# Altium schematic sheet DEVICE2.SchDoc
size A4
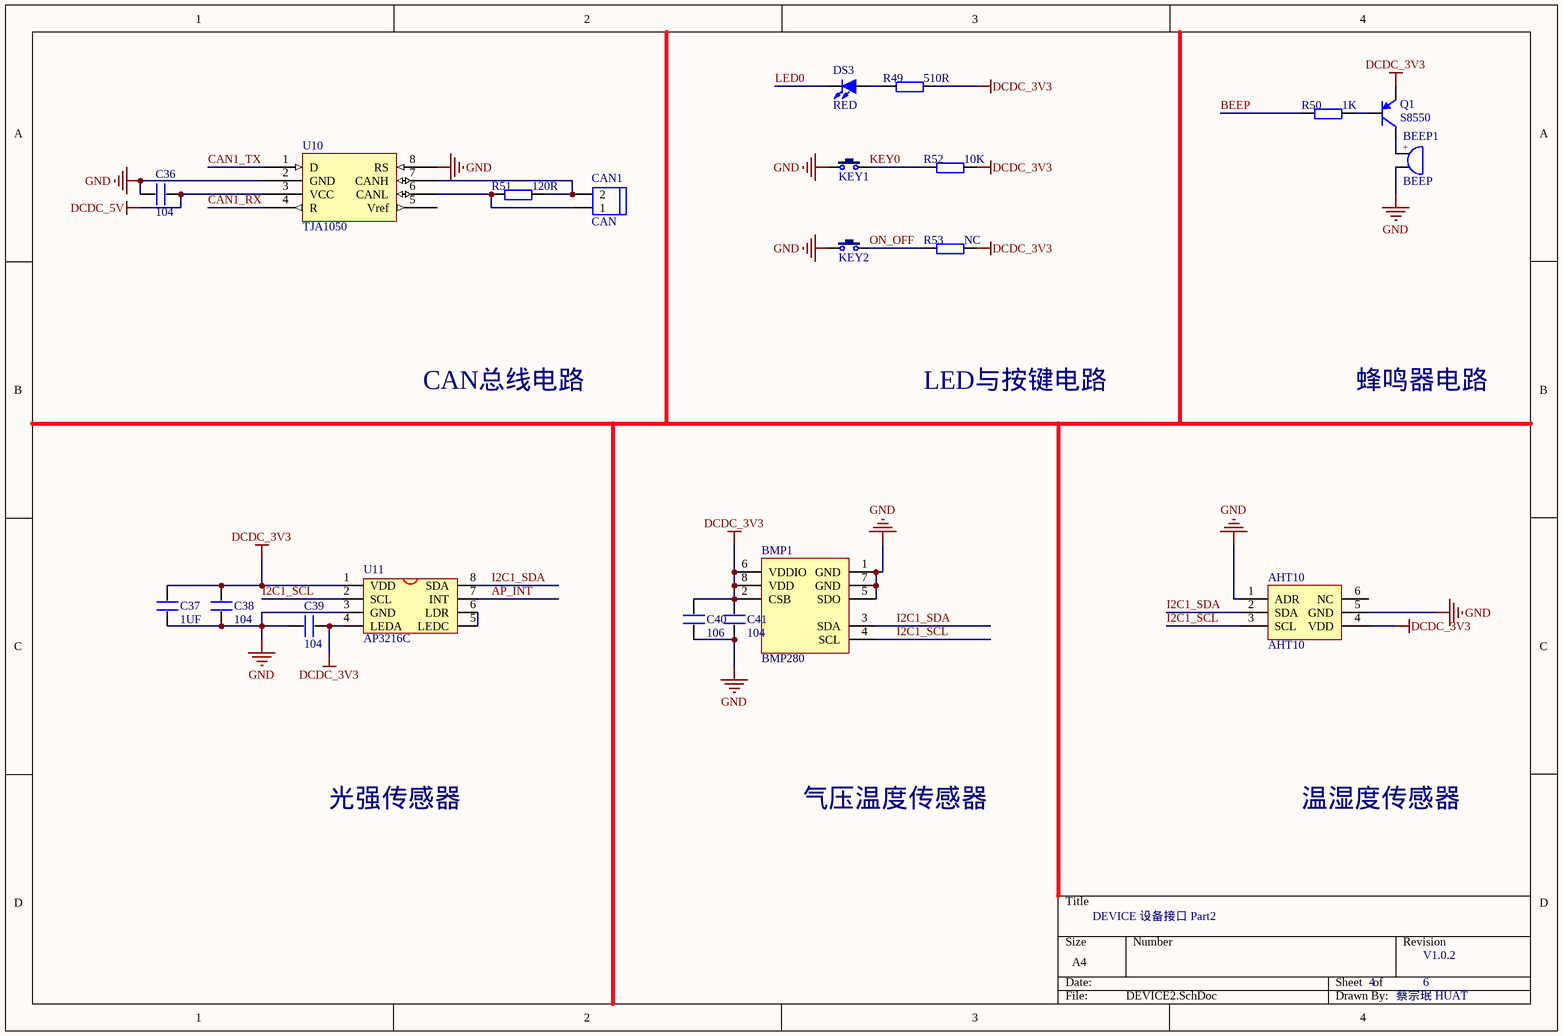
[diagram p0: DEVICE2.SchDoc]

## Parts
AHT10  AHT10  [AHT10 温湿度传感器]
BEEP1  BEEP  [BEEP 5x9x5.5]
BMP1  BMP280  [BMP280]
C36  104  [C_0603P]
C37  1UF  [C_0603P]
C38  104  [C_0603P]
C39  104  [C_0603P]
C40  106  [C_0603P]
C41  104  [C_0603P]
CAN1  CAN  [KF301-2P]
DS3  RED  [LED 0805R]
KEY1  KEY  [TSW DIP-6*6*5 - 2]  (value not drawn)
KEY2  KEY  [TSW DIP-6*6*5 - 2]  (value not drawn)
Q1  S8550  [SOT23-3L]
R49  510R  [R_0603P]
R50  1K  [R_0603P]
R51  120R  [R_0603P]
R52  10K  [R_0603P]
R53  NC  [R_0603P]
U10  TJA1050  [SOP8_N]
U11  AP3216C  [QFN8]

## Nets
DCDC_3V3: AHT10.4(VDD) BMP1.2(CSB) BMP1.6(VDDIO) BMP1.8(VDD) C37.2 C38.2 C39.2 C40.1 C41.1 Q1.2(E) R49.2 R52.2 R53.2 U11.1(VDD) U11.4(LEDA)
DCDC_5V: C36.2 U10.3(VCC)
GND: AHT10.1(ADR) AHT10.5(GND) BEEP1.2 BMP1.1(GND) BMP1.5(SDO) BMP1.7(GND) C36.1 C37.1 C38.1 C39.1 C40.2 C41.2 KEY1.1 KEY2.1 U10.2(GND) U10.8(RS) U11.3(GND)
AP_INT: U11.7(INT)
BEEP: R50.1
CAN1_RX: U10.4(R)
CAN1_TX: U10.1(D)
I2C1_SCL: AHT10.3(SCL) BMP1.4(SCL) U11.2(SCL)
I2C1_SDA: AHT10.2(SDA) BMP1.3(SDA) U11.8(SDA)
KEY0: KEY1.2 R52.1
LED0: DS3.2(K)
ON_OFF: KEY2.2 R53.1
NetBEEP1_1: BEEP1.1 Q1.3(C)
NetCAN1_1: CAN1.1 R51.1 U10.6(CANL)
NetCAN1_2: CAN1.2 R51.2 U10.7(CANH)
NetDS3_1: DS3.1(A) R49.1
NetQ1_1: Q1.1(B) R50.2
NetU11_5: U11.5(LEDC) U11.6(LDR)

Not connected (* = marked no-connect by the designer): AHT10 6(NC); U10 5(Vref)

## Notes on the sheet
- CAN总线电路
- LED与按键电路
- 蜂鸣器电路
- 光强传感器
- 气压温度传感器
- 温湿度传感器
- DEVICE 设备接口 Part2
- 4
- 6
- V1.0.2
- 蔡宗珉 HUAT
- (in symbol BEEP) +

## Library data of the parts
AHT10 = AHT10 温湿度传感器
BEEP1 = BEEP: 蜂鸣器; 版权归属: 源创客; BOM名称: 蜂鸣器; 学习资源: www.ooocke.com
C36-C41 = C
CAN1 = HEAD2
DS3 = LED-SMD: 贴片LED; 版权归属: 源创客; BOM名称: 贴片LED; 学习资源: www.ooocke.com
KEY1 KEY2 = KEY: 按键; BOM名称: 3x6轻触开关; 版权归属: 源创客; 学习资源: www.ooocke.com
Q1 = 8550-SMD: 高频放大-PNP型; 版权归属: 源创客; 属性: 40V 1.5A 1W 100MHZ; BOM名称: 高频放大-PNP型; 学习资源: www.ooocke.com
R49-R53 = R
U10 = SN65HVD230D
U11 = AP3216C: ALS+PS Sensor